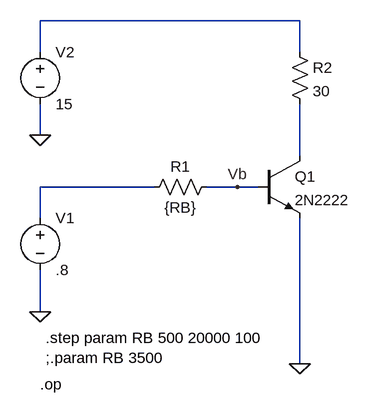
[diagram p0: schematic npn3.asc]
npn3.asc, the LTspice schematic file:
Version 4.1
SHEET 1 1112 680
WIRE 240 -80 -160 -80
WIRE -160 -32 -160 -80
WIRE 240 -32 240 -80
WIRE -160 96 -160 48
WIRE 240 128 240 48
WIRE 16 176 -160 176
WIRE 144 176 96 176
WIRE 176 176 144 176
WIRE -160 224 -160 176
WIRE -160 368 -160 304
WIRE 240 448 240 224
FLAG -160 368 0
FLAG 240 448 0
FLAG 144 176 Vb
FLAG -160 96 0
SYMBOL npn 176 128 R0
SYMATTR InstName Q1
SYMATTR Value 2N2222
SYMBOL voltage -160 208 R0
WINDOW 123 0 0 Left 0
WINDOW 39 0 0 Left 0
SYMATTR InstName V1
SYMATTR Value .8
SYMBOL res 0 192 R270
WINDOW 0 32 56 VTop 2
WINDOW 3 0 56 VBottom 2
SYMATTR InstName R1
SYMATTR Value {RB}
SYMBOL res 224 -48 R0
SYMATTR InstName R2
SYMATTR Value 30
SYMBOL voltage -160 -48 R0
SYMATTR InstName V2
SYMATTR Value 15
TEXT -152 408 Left 2 !.step param RB 500 20000 100\n;.param RB 3500
TEXT -160 480 Left 2 !.op

The netlist it stands for:
* npn3.asc
Q1 N002 Vb 0 0 2N2222
V1 N003 0 .8
R1 N003 Vb {RB}
R2 N001 N002 30
V2 N001 0 15
.model NPN NPN
.model PNP PNP
.lib standard.bjt
.step param RB 500 20000 100
;.param RB 3500
.op
.backanno
.end